# Altium project 02_MCU-ALEKSEJ.PrjPCB
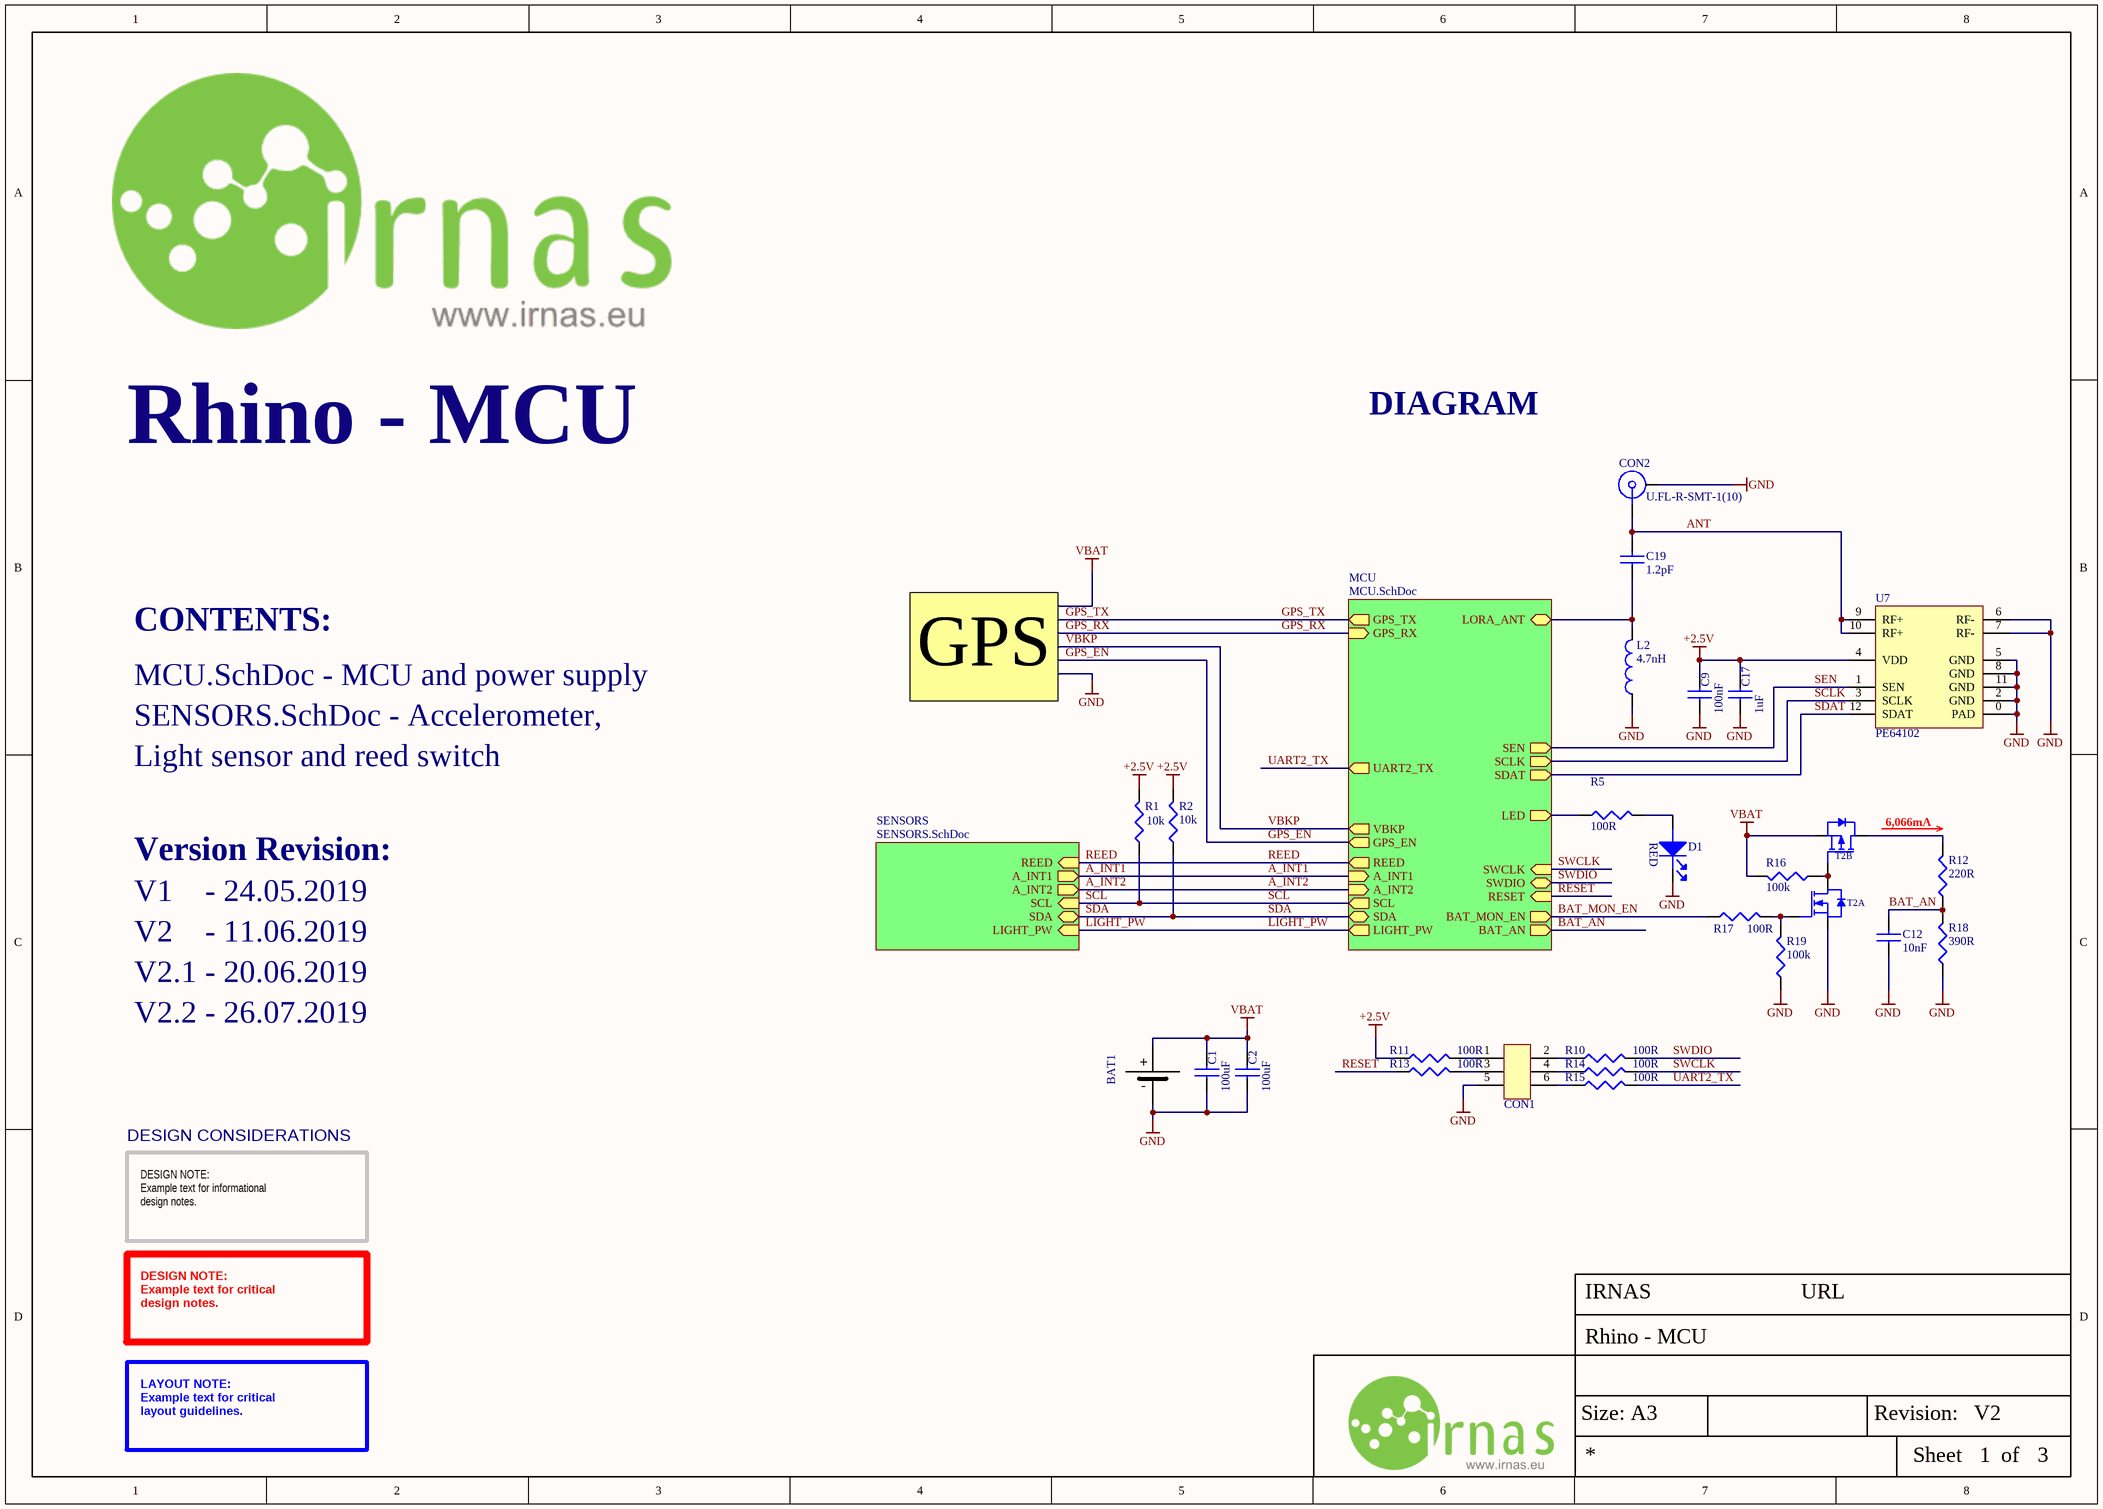
[diagram p0: MAIN.SchDoc]
Company: IRNAS; CreateDate: 13.05.2019; PCBDesigner: Aleksej Cegner; ProjectTitle: Rhino - MCU; RevisionDate: dd.mm.yyyy; Version: V2; Website: URL
3 sheets, 54 parts. Net scope: hierarchical (ports join the sheet entries above them; power ports are global).
Board files: MCU.PcbDoc, RHINO_V2_PANEL.PcbDoc
Sheets:
  MAIN.SchDoc
    SENSORS = SENSORS.SchDoc
    MCU = MCU.SchDoc

## Sheet MAIN.SchDoc
size A3; DocumentNumber: 1; SheetNumber: 1; SheetTotal: 3

### Parts
BAT1  SAFT LS 14250PFR  [SAFT LS 14250PFR]  (value not drawn)
C1  100uF  [CAP0805]
C2  100uF  [CAP0805]
C9  100nF  [CAP0402]
C12  10nF  [CAP0402]
C17  1uF  [CAP0402]
C19  1.2pF  [CAP0402]
CON1  Tag connect  [TC2030-IDC-NL]  (value not drawn)  (no BOM)
CON2  U.FL-R-SMT-1(10)  [ufl connector smd]
D1  LED RED  [LED0603]  (value not drawn)
L2  4.7nH  [IND0402]
R1  10k  [RES0402]
R2  10k  [RES0402]
R5  100R  [RES0402]
R10  100R  [RES0402]
R11  100R  [RES0402]
R12  220R  [RES0402]
R13  100R  [RES0402]
R14  100R  [RES0402]
R15  100R  [RES0402]
R16  100k  [RES0402]
R17  100R  [RES0402]
R18  390R  [RES0402]
R19  100k  [RES0402]
T2  VT6M1T2CR  [VMT6]  (value not drawn)  (parts A,B of 2)
U7  PE64102  [QFN-12]

### Sub-sheets
MCU = MCU.SchDoc: RESET (in), GPS_RX (in), SCL (out), LORA_ANT (bidir), SWDIO (bidir), GPS_EN (out), GPS_TX (out), SWCLK (in), SDA (bidir), A_INT2 (in), A_INT1 (in), REED (out), VBKP (out), BAT_AN (out), BAT_MON_EN (out), LED (out), UART2_TX (out), LIGHT_PW (out), SDAT (out), SCLK (out), SEN (out)
SENSORS = SENSORS.SchDoc: A_INT1 (out), SCL (in), SDA (bidir), A_INT2 (out), LIGHT_PW (in), REED (in)

### Nets
+2.5V: C9.2 C17.2 R1.2 R2.2 R11.1 U7.4(VDD)
GND: BAT1.1(Negative) C1.1 C2.1 C9.1 C12.1 C17.1 CON1.5 CON2.2 D1.1(cathode) L2.1 R18.1 R19.1 T2.1(S1) U7.0(PAD) U7.2(GND) U7.5(GND) U7.6(RF-) U7.7(RF-) U7.8(GND) U7.11(GND)
VBAT: BAT1.2(Positive) C1.2 C2.2 R16.2 T2.4(S2)
A_INT1: sheet SENSORS/A_INT1, sheet MCU/A_INT1
A_INT2: sheet SENSORS/A_INT2, sheet MCU/A_INT2
ANT: C19.2 CON2.1 U7.9(RF+) U7.10(RF+)
BAT_AN: C12.2 R12.1 R18.2 ; sheet MCU/BAT_AN
BAT_MON_EN: R17.1 ; sheet MCU/BAT_MON_EN
LED: R5.1 ; sheet MCU/LED
LIGHT_PW: sheet SENSORS/LIGHT_PW, sheet MCU/LIGHT_PW
LORA_ANT: C19.1 L2.2 ; sheet MCU/LORA_ANT
REED: sheet SENSORS/REED, sheet MCU/REED
RESET: R13.1 ; sheet MCU/RESET
SCL: R1.1 ; sheet SENSORS/SCL, sheet MCU/SCL
SCLK: U7.3(SCLK) ; sheet MCU/SCLK
SDA: R2.1 ; sheet SENSORS/SDA, sheet MCU/SDA
SDAT: U7.12(SDAT) ; sheet MCU/SDAT
SEN: U7.1(SEN) ; sheet MCU/SEN
SWCLK: R14.2 ; sheet MCU/SWCLK
SWDIO: R10.2 ; sheet MCU/SWDIO
UART2_TX: R15.2 ; sheet MCU/UART2_TX
NetCON1_1: CON1.1 R11.2
NetCON1_2: CON1.2 R10.1
NetCON1_3: CON1.3 R13.2
NetCON1_4: CON1.4 R14.1
NetCON1_6: CON1.6 R15.1
NetD1_2: D1.2(ANODE) R5.2
NetR12_2: R12.2 T2.3(D2)
NetR16_1: R16.1 T2.5(G2) T2.6(D1)
NetR17_2: R17.2 R19.2 T2.2(G1)

### Notes on the sheet
- DIAGRAM
- CONTENTS:
- MCU.SchDoc - MCU and power supply
- GPS
- SENSORS.SchDoc - Accelerometer,
- Light sensor and reed switch
- 6,066mA
- Version Revision:
- V1    - 24.05.2019
- V2    - 11.06.2019
- V2.1 - 20.06.2019
- V2.2 - 26.07.2019
- DESIGN CONSIDERATIONS
- DESIGN NOTE:
  Example text for informational
  design notes.
- DESIGN NOTE:
  Example text for critical
  design notes.
- LAYOUT NOTE:
  Example text for critical
  layout guidelines.
- Size: A3
- Revision:
- Sheet
- of
- (in symbol BAT - SAFT LS 14250PFR) +; -
- (in symbol LED - LED RED) RED

### Library data of the parts
BAT1 = BAT - SAFT LS 14250PFR: Battery: lithium; 3.6V; 1/2AA; 3pin,positive pole: 1pin; 1200mAh; Supplier 1: TME; Supplier Part Number 1: SAFT-LS14250PFR
C1 C2 = C - 100uF/0805: Multilayer Ceramic Capacitors MLCC - SMD/SMT 0805 100uF 4volts *Derate Voltage/Temp; Manufacturer: Murata; Manufacturer Part Number: GRM21BR60G107ME15L; IRNAS Part No.: /; Tolerance: 20%; Dielectric: X5R; Voltage Rating (DC): 4V; Dissipation Factor: 0.1%; Supplier 1: Farnell; Stock 1: 529; Pricing 1: 5=0.775, 50=0.463, 250=0.405, 500=0.289, 1500=0.243, 3000=0.229, 15000=0.21 (GBP); Mount: Surface Mount; Case/Package: 0805; Weight: 0.000335oz; Case Code (Metric): 2012; Case Code (Imperial): 0805; Dielectric Material: Ceramic; Min Operating Temperature: -55°C; Max Operating Temperature: 85°C; Packaging: Tape and Reel; Voltage Rating: 4V; Voltage: 4V; Termination: SMD/SMT; Package Quantity: 3000; Capacitance: 100uF; Length: 2mm; Height: 1.25mm; Width: 0.049inch; Thickness: 0.057inch; Depth: 1.25mm; REACH SVHC: No SVHC; Lead Free: Lead Free; ComponentLink1URL: http://www.farnell.com/datasheets/2079181.pdf; ComponentLink1Description: http://www.farnell.com/datasheets/2079181.pdf; ComponentLink2URL: http://search.murata.co.jp/Ceramy/image/img/A01X/partnumbering_e_01.pdf; ComponentLink2Description: http://search.murata.co.jp/Ceramy/image/img/A01X/partnumbering_e_01.pdf; ComponentLink3URL: http://psearch.en.murata.com/capacitor/product/GRM21BR60G107ME15%23.pdf; ComponentLink3Description: http://psearch.en.murata.com/capacitor/product/GRM21BR60G107ME15%23.pdf; ComponentLink4URL: http://www.mouser.com/ds/2/281/c02e-2905.pdf; ComponentLink4Description: http://www.mouser.com/ds/2/281/c02e-2905.pdf; Supplier Part Number 1: 2611937
C9 = C - 100nF/0402: MULTICOMP         MC0402X104J160CT             SMD Multilayer Ceramic Capacitor, 0402 [1005 Metric], 0.1 F, 16 V,  5%, X5R, MC Series                          New; IRNAS Part No.: /; Voltage Rating: 16V; Supplier 1: Farnell; Manufacturer: Multicomp; Manufacturer Part Number: MC0402X104J160CT; Stock 1: 3230; Pricing 1: 10=0.0139, 100=0.0108, 500=0.0076, 2500=0.0051, 5000=0.0038 (EUR); Case Code (Metric): 1005; Case Code (Imperial): 0402; Min Operating Temperature: -55°C; Max Operating Temperature: 85°C; Capacitance: 100nF; Dielectric: X5R; Packaging: Tape and Reel; Tolerance: 5%; Voltage Rating (DC): 16V; REACH SVHC: No SVHC; ComponentLink1URL: http://www.farnell.com/datasheets/2117933.pdf; ComponentLink1Description: http://www.farnell.com/datasheets/2117933.pdf; ComponentLink2URL: http://www.farnell.com/datasheets/2117900.pdf; ComponentLink2Description: http://www.farnell.com/datasheets/2117900.pdf; Supplier Part Number 1: 2627419
C12 = C - 10nF/0402: CAP CER 10000PF 16V X7R 0402; Manufacturer: Murata; Manufacturer Part Number: GRM155R71C103KA01D; IRNAS Part No.: /; Tolerance: 10%; Stock 1: 16478; Pricing 1: 10=0.0216, 100=0.0151, 500=0.0104, 2500=0.0069, 5000=0.0056 (EUR); Mount: Surface Mount; Case/Package: 0402; Number of Pins: 2; Case Code (Metric): 1005; Case Code (Imperial): 0402; Min Operating Temperature: -55°C; Max Operating Temperature: 125°C; Package Quantity: 1; Capacitance: 10nF; Voltage Rating: 16V; Packaging: Tape and Reel; Voltage Rating (DC): 16V; Dielectric: X7R; Termination: SMD/SMT; Voltage: 16V; Length: 1mm; Height: 0.5mm; Width: 0.02inch; Thickness: 0.022inch; Depth: 0.5mm; Radiation Hardening: No; REACH SVHC: No SVHC; Lead Free: Lead Free; ComponentLink1URL: https://datasheet.ciiva.com/129/partnumbering-e-01-129774.pdf; ComponentLink1Description: https://datasheet.ciiva.com/129/partnumbering-e-01-129774.pdf; ComponentLink2URL: https://datasheet.ciiva.com/129/partnumbering-e-01-129775.pdf; ComponentLink2Description: https://datasheet.ciiva.com/129/partnumbering-e-01-129775.pdf; ComponentLink3URL: https://datasheet.ciiva.com/129/product-129776.pdf; ComponentLink3Description: https://datasheet.ciiva.com/129/product-129776.pdf; ComponentLink4URL: https://datasheet.ciiva.com/18184/getdatasheetpartid-178863-18184649.pdf; ComponentLink4Description: https://datasheet.ciiva.com/18184/getdatasheetpartid-178863-18184649.pdf; ComponentLink5URL: https://datasheet.ciiva.com/22698/608985-22698415.pdf; ComponentLink5Description: https://datasheet.ciiva.com/22698/608985-22698415.pdf; ComponentLink6URL: https://datasheet.ciiva.com/7937/608985-7937614.pdf; ComponentLink6Description: https://datasheet.ciiva.com/7937/608985-7937614.pdf; Supplier 1: Farnell; Supplier Part Number 1: 2407354
C17 = C - 1uF/0402: CAP CER 1UF 10V 20% X5R 0402; Manufacturer: Murata; Manufacturer Part Number: GRM155R61A105ME15D; IRNAS Part No.: /; Stock 1: 0; Pricing 1: 10=0.0379, 100=0.0266, 500=0.0156, 2500=0.0098, 5000=0.0083 (EUR); Mount: Surface Mount; Case/Package: 0402; Case Code (Metric): 1005; Case Code (Imperial): 0402; Min Operating Temperature: -55°C; Max Operating Temperature: 85°C; Capacitance: 1uF; Tolerance: 20%; Voltage Rating: 10V; Packaging: Tape and Reel; Package Quantity: 1; Dielectric: X5R; Voltage: 10V; Voltage Rating (DC): 10V; Length: 1mm; Height: 0.5mm; Width: 0.02inch; Thickness: 0.022inch; Depth: 0.5mm; Radiation Hardening: No; REACH SVHC: No SVHC; Lead Free: Lead Free; ComponentLink1URL: https://datasheet.ciiva.com/164/product-164665.pdf; ComponentLink1Description: https://datasheet.ciiva.com/164/product-164665.pdf; ComponentLink2URL: https://datasheet.ciiva.com/11616/product-11616508.pdf; ComponentLink2Description: https://datasheet.ciiva.com/11616/product-11616508.pdf; ComponentLink3URL: https://datasheet.ciiva.com/46418/1769893-46418047.pdf; ComponentLink3Description: https://datasheet.ciiva.com/46418/1769893-46418047.pdf; ComponentLink4URL: https://datasheet.ciiva.com/164/partnumbering-e-01-164666.pdf; ComponentLink4Description: https://datasheet.ciiva.com/164/partnumbering-e-01-164666.pdf; ComponentLink5URL: https://datasheet.ciiva.com/164/partnumbering-e-01-164667.pdf; ComponentLink5Description: https://datasheet.ciiva.com/164/partnumbering-e-01-164667.pdf; Supplier 1: Farnell; Supplier Part Number 1: 1740588
C19 = C - 4.7nF/0402: CAP CER 4700PF 50V X7R 0402; Manufacturer: KEMET; Manufacturer Part Number: C0402C472K5RAC-TU; IRNAS Part No.: /; Dielectric Material: Ceramic; Capacitance: 4.7nF; Tolerance: 10%; Supplier 1: Farnell; Stock 1: 98953; Pricing 1: 10=0.0321, 100=0.0144, 500=0.0081, 2500=0.0057, 5000=0.0048 (EUR); Mount: Surface Mount,PCB; Case/Package: 0402; Number of Pins: 2; Case Code (Imperial): 0402; Case Code (Metric): 1005; Min Operating Temperature: -55°C; Max Operating Temperature: 125°C; Voltage Rating: 50V; Voltage Rating (DC): 50V; Packaging: Tape and Reel; Package Quantity: 1; Dielectric: X7R; Termination: SMD/SMT; Voltage: 50V; Length: 1mm; Height: 0.5mm; Width: 0.02inch; Lead Pitch: 0.3mm; Thickness: 0.022inch; Depth: 0.5mm; Radiation Hardening: No; REACH SVHC: No SVHC; ComponentLink1URL: https://datasheet.ciiva.com/7747/40889-7747549.pdf; ComponentLink1Description: https://datasheet.ciiva.com/7747/40889-7747549.pdf; ComponentLink2URL: https://datasheet.ciiva.com/7747/40889-7747550.pdf; ComponentLink2Description: https://datasheet.ciiva.com/7747/40889-7747550.pdf; ComponentLink3URL: https://datasheet.ciiva.com/14604/70095383-14604382.pdf; ComponentLink3Description: https://datasheet.ciiva.com/14604/70095383-14604382.pdf; ComponentLink4URL: https://datasheet.ciiva.com/6074/kem-c1002-x7r-smd-6074645.pdf; ComponentLink4Description: https://datasheet.ciiva.com/6074/kem-c1002-x7r-smd-6074645.pdf; ComponentLink5URL: https://datasheet.ciiva.com/14602/70095383-14602057.pdf; ComponentLink5Description: https://datasheet.ciiva.com/14602/70095383-14602057.pdf; ComponentLink6URL: https://datasheet.ciiva.com/18102/getdatasheetpartid-63228-18102058.pdf; ComponentLink6Description: https://datasheet.ciiva.com/18102/getdatasheetpartid-63228-18102058.pdf; Supplier Part Number 1: 1414594
CON1 = tag connecot 6 pin
CON2 = U.FL-R-SMT-1(10): RF / Coaxial Connector, U.FL Coaxial, Straight Jack, Surface Mount Vertical, 50 ohm, Brass; Manufacturer: Hirose; Featured Product: U.FL Series Connectors; Connector Style: U.FL, Ultra Miniature Coaxial; Connector Type: Receptacle, Male Pin; Contact Termination: Solder; Impedance: 50 Ohm; Frequency - Max: 6GHz; Body Material: Phosphor Bronze; Body Finish: Silver; Center Contact Plating: Gold; Dielectric Material: Liquid Crystal Polymer (LCP); Online Catalog: UMCC (Ultra Miniature Coax Connectors), U.FL Series; Other Names: H11891TR  Q5400621  U.FL-R-SMT-1 10  U.FL-R-SMT-1(10)-ND  UFLRSMT110; Supplier 1: Farnell; Manufacturer Part Number: U.FL-R-SMT-1(10); Stock 1: 0; Standard Package: 2,500; Category: Connectors, Interconnects; Family: Coaxial Connectors (RF); Series: U.FL; Packaging: Tape & Reel (TR); Shield Termination: Solder; Mounting Type: Surface Mount; Cable Group: -; Fastening Type: Snap-On; Features: -; Housing Color: Beige; Ingress Protection: -; Center Contact Material: Brass; Voltage Rating: -; Operating Temperature: -40°C ~ 90°C; ComponentLink1URL: http://www.farnell.com/datasheets/91524.pdf; ComponentLink1Description: http://www.farnell.com/datasheets/91524.pdf; ComponentLink2URL: http://uk.rs-online.com/webdocs/1363/0900766b81363563.pdf; ComponentLink2Description: http://uk.rs-online.com/webdocs/1363/0900766b81363563.pdf; ComponentLink3URL: http://www.farnell.com/datasheets/1947917.pdf; ComponentLink3Description: http://www.farnell.com/datasheets/1947917.pdf; Supplier Part Number 1: 1688077
D1 = LED - LED RED: BROADCOM LIMITED - HSMS-C190 - LED, RED, 10MCD, 626NM; LED Mounting: SMD; Forward Current If: 20; Forward Voltage: 2.1; Wavelength Typ: 626; Luminous Intensity: 10; Viewing Angle: 170°; Lens Shape: Rectangular; SVHC: No SVHC (17-Dec-2015)<!--FANDB--><div class="features-and-benefits-container"><div class="features-and-benefits-description"><span class="features-benefits-value">The HSMS-C190 is a HER SMD Chip LED with untinted/diffused lens, made of GaP. It is designed in an industry standard package 1.6 x 0.8mm footprint with 0.8mm profile. It is compatible with IR reflow solder processes. The small size and wide viewing angle make this LED prime choices for backlighting applications and front panel illumination especially where space is a premium.</span></div><div class="features-and-benefits-list"><ul class="features-and-benefits-list-list"><li class="features-and-benefits-list-item">Small size</li><li class="features-and-benefits-list-item">Industry standard footprint</li><li class="features-and-benefits-list-item">Compatible with IR solder</li><li class="features-and-benefits-list-item">Diffused optics</li><li class="features-and-benefits-list-item">-40 to 85; Supplier 1: Farnell; Manufacturer: BROADCOM LIMITED; Manufacturer Part Number: HSMS-C190; RoHS: YES; Stock 1: 7534; Pricing 1: 1=0.361, 10=0.256, 50=0.235, 100=0.106, 200=0.101 (GBP); LED Colour: Red; Bulb Size: -; Packaging: Cut Tape; Product Range: -; Automotive Qualification Standard: -; MSL: -; ComponentLink1URL: http://www.farnell.com/datasheets/313031.pdf; ComponentLink1Description: http://www.farnell.com/datasheets/313031.pdf; ComponentLink2URL: http://www.farnell.com/datasheets/1681524.pdf; ComponentLink2Description: http://www.farnell.com/datasheets/1681524.pdf; ComponentLink3URL: http://www.farnell.com/datasheets/2165483.pdf; ComponentLink3Description: http://www.farnell.com/datasheets/2165483.pdf; Supplier Part Number 1: 2497356
L2 = L - 4.3nH/0402: Inductor RF Chip Multi-Layer 4.3nH 0.3nH 100MHz 8Q-Factor Air 300mA 210mOhm DCR 0402 Paper T/R; Manufacturer: Murata; Manufacturer Part Number: LQG15HN4N3S02D; IRNAS Part No.: /; Q Factor: 8; Self Resonant Frequency: 6GHz; Shielding: Unshielded; DC Resistance (DCR): 210mR; Stock 1: 3502; Pricing 1: 1 = 0.10000, 10 = 0.06100, 100 = 0.04040, 500 = 0.03366, 1000 = 0.02827, 2500 = 0.02423 (USD); RoHS: Yes; Mount: Surface Mount; Case/Package: 0402; Core Material: Air; Case Code (Metric): 1005; Case Code (Imperial): 0402; Min Operating Temperature: -55°C; Max Operating Temperature: 125°C; Package Quantity: 10000; Packaging: Tape and Reel; Current Rating: 300mA; Inductance: 4.3nh; Test Frequency: 100MHz; Max DC Current: 300mA; Termination: SMD/SMT; Current: 300mA; DC Current: 300mA; Military Standard: Not; Length: 1.05mm; Height: 0.5mm; Width: 0.02inch; Height - Seated (Max): 0.022inch; Depth: 0.55mm; Radiation Hardening: No; REACH SVHC: No SVHC; Lead Free: Lead Free; ComponentLink1URL: http://uk.rs-online.com/webdocs/0f10/0900766b80f10808.pdf?src-supplier=RSComponents; ComponentLink1Description: http://uk.rs-online.com/webdocs/0f10/0900766b80f10808.pdf?src-supplier=RSComponents; ComponentLink2URL: http://search.murata.co.jp/Ceramy/image/img/PDF/ENG/L0075S0083LQG15HN.pdf?src-supplier=Avnet; ComponentLink2Description: http://search.murata.co.jp/Ceramy/image/img/PDF/ENG/L0075S0083LQG15HN.pdf?src-supplier=Avnet; ComponentLink3URL: http://www.farnell.com/datasheets/66026.pdf?src-supplier=Element14; ComponentLink3Description: http://www.farnell.com/datasheets/66026.pdf?src-supplier=Element14; ComponentLink4URL: https://www.verical.com/server-webapp/html/getDatasheet?partID=31252&src-supplier=Verical; ComponentLink4Description: https://www.verical.com/server-webapp/html/getDatasheet?partID=31252&src-supplier=Verical; ComponentLink5URL: http://search.murata.co.jp/Ceramy/image/img/PDF/ENG/L0075S0083LQG15HN.pdf?src-supplier=Avnet+Europe; ComponentLink5Description: http://search.murata.co.jp/Ceramy/image/img/PDF/ENG/L0075S0083LQG15HN.pdf?src-supplier=Avnet+Europe; ComponentLink6URL: https://search.murata.co.jp/Ceramy/image/img/P02/partnumberingAT_LQ3E.pdf?src-supplier=Digi-Key; ComponentLink6Description: https://search.murata.co.jp/Ceramy/image/img/P02/partnumberingAT_LQ3E.pdf?src-supplier=Digi-Key; Supplier 1: Farnell; Supplier Part Number 1: 1711735
R1 R2 = R - 10k/0402: MULTICOMP         MCWR04X1002FTL             SMD Chip Resistor, Thick Film, 10 kohm, 50 V, 0402 [1005 Metric], 62.5 mW,  1%, MCWR Series; IRNAS Part No.: I-100014; Resistance: 10kR; Voltage Rating: 50V; Power Rating: 62.5mW; Temperature Coefficient: 100ppm/°C; Supplier 1: Farnell; Manufacturer: Multicomp; Manufacturer Part Number: MCWR04X1002FTL; Stock 1: 602609; Pricing 1: 10=0.0029, 100=0.0017, 500=0.0012, 2500=0.001, 5000=0.0008 (EUR); Case/Package: 0402; Case Code (Metric): 1005; Case Code (Imperial): 0402; Packaging: Cut Tape; Composition: Thick Film; Tolerance: 1%; Voltage Rating (DC): 50V; REACH SVHC: No SVHC; ComponentLink1URL: http://www.farnell.com/datasheets/1849611.pdf; ComponentLink1Description: http://www.farnell.com/datasheets/1849611.pdf; Supplier Part Number 1: 2447096
R5 R10 R11 R13-R15 R17 = R - 100R/0402: MULTICOMP         MCMR04X1000FTL            SMD Chip Resistor, Ceramic, MCMR Series, 100 ohm, 50 V, 0402 [1005 Metric], 62.5 mW,  1%; IRNAS Part No.: /; Temperature Coefficient: 100ppm/°C; Power Rating: 62.5mW; Voltage Rating: 50V; Supplier 1: Farnell; Manufacturer: Multicomp; Manufacturer Part Number: MCMR04X1000FTL; Stock 1: 62365; Pricing 1: 10=0.0071, 100=0.0042, 500=0.003, 2500=0.0024, 5000=0.0019 (GBP); Case/Package: 0402; Case Code (Metric): 1005; Case Code (Imperial): 0402; Resistance: 100R; Tolerance: 1%; Composition: Ceramic; Packaging: Cut Tape; Voltage Rating (DC): 50V; REACH SVHC: No SVHC; ComponentLink1URL: https://datasheet.ciiva.com/28692/1716705-28692087.pdf; ComponentLink1Description: https://datasheet.ciiva.com/28692/1716705-28692087.pdf; ComponentLink2URL: https://datasheet.ciiva.com/22708/1716705-22708156.pdf; ComponentLink2Description: https://datasheet.ciiva.com/22708/1716705-22708156.pdf; Supplier Part Number 1: 2072515
R12 = R - 220R/0402: SMD Chip Resistor, 0402 [1005 Metric], 220 ohm, CRCW e3 Series, 50 V, Thick Film, 63 mW; Manufacturer: Multicomp; IRNAS Part No.: /; Voltage Rating: 50V; Power Rating: 62.5mW; Temperature Coefficient: 400ppm/°C; Stock 1: 0; Pricing 1: 10=0.0057, 100=0.0034, 500=0.0024, 2500=0.0019, 5000=0.0015 (EUR); Case/Package: 0402; Case Code (Metric): 1005; Case Code (Imperial): 0402; Packaging: Cut Tape; Resistance: 220R; Composition: Ceramic; Voltage Rating (DC): 50V; REACH SVHC: No SVHC; ComponentLink1URL: http://www.farnell.com/datasheets/2310790.pdf?_ga=2.80708247.1822379758.1564985606-1373726713.1554121096&_gac=1.157944520.1562763802.CjwKCAjwmZbpBRAGEiwADrmVXm8xT8OHDZvJe8qZIQyyGmIuiUD-TEITatw0hIdDkyBwIXXCH7oneRoCl7cQAvD_BwE; ComponentLink1Description: Datasheet; Supplier 1: Farnell; Supplier Part Number 1: 2140704
R16 R19 = R - 100k/0402: MULTICOMP   MCWR04X1003FTL   RES, THICK FILM, 100KOHM, 1%, 0.0625W; IRNAS Part No.: I-100013; Resistance: 100kR; Power Rating: 62.5mW; Voltage Rating: 50V; Temperature Coefficient: 100ppm/°C; Supplier 1: Farnell; Manufacturer: Multicomp; Manufacturer Part Number: MCWR04X1003FTL; Stock 1: 161188; Pricing 1: 10=0.0029, 100=0.0017, 500=0.0012, 2500=0.001, 5000=0.0008 (EUR); Mount: Surface Mount; Case/Package: 0402; Case Code (Metric): 1005; Case Code (Imperial): 0402; Tolerance: 1%; Packaging: Cut Tape; Composition: Thick Film; Voltage Rating (DC): 50V; REACH SVHC: No SVHC; ComponentLink1URL: https://datasheet.ciiva.com/46386/1849611-46386524.pdf; ComponentLink1Description: https://datasheet.ciiva.com/46386/1849611-46386524.pdf; Supplier Part Number 1: 2447094
R18 = R - 390R/0402: SMD Chip Resistor, 0402 [1005 Metric], 390 ohm, MCWR Series, 50 V, Thick Film, 62.5 mW; Manufacturer: Multicomp; IRNAS Part No.: /; Voltage Rating: 50V; Power Rating: 62.5mW; Temperature Coefficient: 400ppm/°C; Stock 1: 0; Pricing 1: 10=0.0057, 100=0.0034, 500=0.0024, 2500=0.0019, 5000=0.0015 (EUR); Case/Package: 0402; Case Code (Metric): 1005; Case Code (Imperial): 0402; Packaging: Cut Tape; Resistance: 390R; Composition: Ceramic; Voltage Rating (DC): 50V; REACH SVHC: No SVHC; ComponentLink1URL: http://www.farnell.com/datasheets/2563624.pdf?_ga=2.57959210.1822379758.1564985606-1373726713.1554121096&_gac=1.48955732.1562763802.CjwKCAjwmZbpBRAGEiwADrmVXm8xT8OHDZvJe8qZIQyyGmIuiUD-TEITatw0hIdDkyBwIXXCH7oneRoCl7cQAvD_BwE; ComponentLink1Description: Datasheet; Supplier 1: Farnell; Supplier Part Number 1: 2447165
T2 = T_M - VT6M1T2CR: Dual MOSFET, N and P Channel, 100 mA, 20 V, 2.5 ohm, 4.5 V, 1 V; ELRAD Id sifra / ELRAD Id No: 597778; Opis / Description: MOSFET BSS123       /N-Channel; Komp / Device: SMD; Value: BSS123; Velikost / Size: SOT23; FIT: 0.44; Author: Ciril Golob; Date: 11.07.2018; ComponentLINK1Description: Datasheet; ComponentLINK2Description: Datasheet www; ComponentLINK1URL: c:\ELRADSVN\Altium_Library\Libraries\Active\Datasheet\BSS123.pdf; ComponentLINK2URL: http://www.onsemi.com/pub/Collateral/BSS123-D.PDF; ComponentLink1Description: Datasheet; ComponentLink1URL: http://www.farnell.com/datasheets/2198041.pdf?_ga=2.191543850.1451481302.1563774341-1373726713.1554121096&_gac=1.95045230.1562763802.CjwKCAjwmZbpBRAGEiwADrmVXm8xT8OHDZvJe8qZIQyyGmIuiUD-TEITatw0hIdDkyBwIXXCH7oneRoCl7cQAvD_BwE; Supplier 1: Farnell; Supplier Part Number 1: 2706721
U7 = RF - PE64102: RF IC Digitally Tunable Capacitor General Purpose 100MHz ~ 3GHz SPI Interface 12-QFN (2x2); Manufacturer: u-blox; Manufacturer Part Number: MAX-M8Q-0; Stock 1: 10805; Supplier 1: Digi-Key; Supplier Part Number 1: 1046-1066-1-ND

## Sheet SENSORS.SchDoc
size A3; DocumentNumber: 3; SheetNumber: 3; SheetTotal: 3
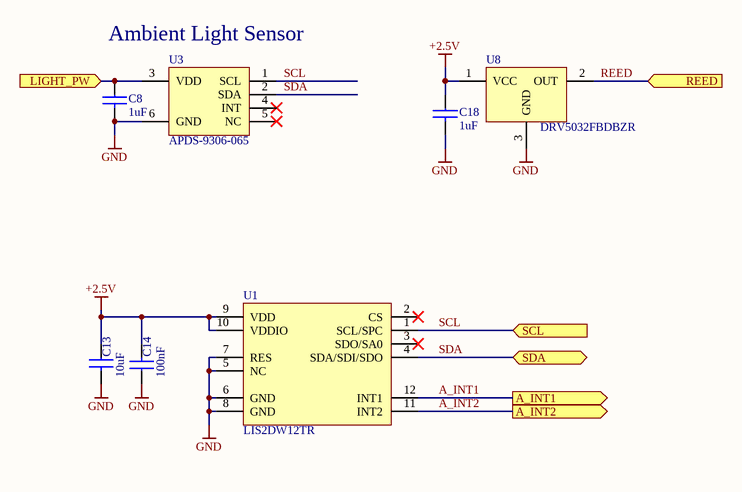
[diagram p1: SENSORS.SchDoc]

### Parts
C8  1uF  [CAP0402]
C13  10uF  [CAP0603]
C14  100nF  [CAP0402]
C18  1uF  [CAP0402]
U1  LIS2DW12TR  [LGA-12]
U3  APDS-9306-065  [APDS-9306]
U8  DRV5032FBDBZR  [SOT23-3AL]

### Ports
A_INT1 (out), A_INT2 (out), LIGHT_PW (in), REED (in), SCL (in), SDA (bidir)

### Nets
+2.5V: C13.1 C14.2 C18.1 U1.9(VDD) U1.10(VDDIO) U8.1(VCC)
GND: C8.2 C13.2 C14.1 C18.2 U1.5(NC) U1.6(GND) U1.7(RES) U1.8(GND) U3.6(GND) U8.3(GND)
A_INT1: U1.12(INT1) ; port A_INT1
A_INT2: U1.11(INT2) ; port A_INT2
LIGHT_PW: C8.1 U3.3(VDD) ; port LIGHT_PW
REED: U8.2(OUT) ; port REED
SCL: U1.1(SCL/SPC) U3.1(SCL) ; port SCL
SDA: U1.4(SDA/SDI/SDO) U3.2(SDA) ; port SDA

Not connected (* = marked no-connect by the designer): U1 2(CS)* 3(SDO/SA0)*; U3 4(INT)* 5(NC)*

### Notes on the sheet
- Ambient Light Sensor
- Size: A3
- Revision:
- Sheet
- of

### Library data of the parts
C8 C18 = C - 1uF/0402: as C17 on sheet MAIN; Stock 1: 0; Pricing 1: 10=0.0379, 100=0.0266, 500=0.0156, 2500=0.0098, 5000=0.0083 (EUR); Mount: Surface Mount; Case/Package: 0402; Case Code (Metric): 1005; Case Code (Imperial): 0402; Min Operating Temperature: -55°C; Max Operating Temperature: 85°C; Capacitance: 1uF; Tolerance: 20%; Voltage Rating: 10V; Packaging: Tape and Reel; Package Quantity: 1; Dielectric: X5R; Voltage: 10V; Voltage Rating (DC): 10V; Length: 1mm; Height: 0.5mm; Width: 0.02inch; Thickness: 0.022inch; Depth: 0.5mm; Radiation Hardening: No; REACH SVHC: No SVHC; Lead Free: Lead Free; ComponentLink1URL: https://datasheet.ciiva.com/164/product-164665.pdf; ComponentLink1Description: https://datasheet.ciiva.com/164/product-164665.pdf; ComponentLink2URL: https://datasheet.ciiva.com/11616/product-11616508.pdf; ComponentLink2Description: https://datasheet.ciiva.com/11616/product-11616508.pdf; ComponentLink3URL: https://datasheet.ciiva.com/46418/1769893-46418047.pdf; ComponentLink3Description: https://datasheet.ciiva.com/46418/1769893-46418047.pdf; ComponentLink4URL: https://datasheet.ciiva.com/164/partnumbering-e-01-164666.pdf; ComponentLink4Description: https://datasheet.ciiva.com/164/partnumbering-e-01-164666.pdf; ComponentLink5URL: https://datasheet.ciiva.com/164/partnumbering-e-01-164667.pdf; ComponentLink5Description: https://datasheet.ciiva.com/164/partnumbering-e-01-164667.pdf; Supplier 1: Farnell; Supplier Part Number 1: 1740588
C13 = C - 10uF/10V: Cap Ceramic 10uF 10V X5R 10% SMD 0603 85C Paper T/R; Manufacturer: Samsung; Manufacturer Part Number: CL10A106KP8NNNC; IRNAS Part No.: /; Stock 1: 2844657; Pricing 1: 1=0.36, 10=0.248, 100=0.1403, 500=0.099, 1000=0.08663 (USD); Mount: Surface Mount; Case/Package: 0603; Case Code (Metric): 1608; Case Code (Imperial): 0603; Material: Ceramic; Contact Plating: Tin; Min Operating Temperature: -55°C; Max Operating Temperature: 85°C; Capacitance: 10uF; Tolerance: 10%; Package Quantity: 1; Packaging: Tape and Reel; Voltage Rating: 10V; Dielectric: X5R; Voltage Rating (DC): 10V; Length: 1.6mm; Height: 0.8mm; Width: 0.031inch; Thickness: 0.035inch; Depth: 0.8mm; Radiation Hardening: No; Lead Free: Lead Free; ComponentLink1URL: https://www.verical.com/server-webapp/html/getDatasheet?partID=359551; ComponentLink1Description: https://www.verical.com/server-webapp/html/getDatasheet?partID=359551; ComponentLink2URL: http://www1.futureelectronics.com/doc/SAMSUNG%20PASSIVE/CL05B104KQ5NNNC.pdf; ComponentLink2Description: http://www1.futureelectronics.com/doc/SAMSUNG%20PASSIVE/CL05B104KQ5NNNC.pdf; ComponentLink3URL: https://produktinfo.conrad.com/datenblaetter/450000-474999/457369-da-01-en-VS_KONDENSATOR_0603.pdf; ComponentLink3Description: https://produktinfo.conrad.com/datenblaetter/450000-474999/457369-da-01-en-VS_KONDENSATOR_0603.pdf; Supplier 1: Farnell; Supplier Part Number 1: 2456110
C14 = C - 100nF/0402: as C9 on sheet MAIN; Supplier 1: Farnell; Manufacturer: Multicomp; Manufacturer Part Number: MC0402X104J160CT; Stock 1: 3230; Pricing 1: 10=0.0139, 100=0.0108, 500=0.0076, 2500=0.0051, 5000=0.0038 (EUR); Case Code (Metric): 1005; Case Code (Imperial): 0402; Min Operating Temperature: -55°C; Max Operating Temperature: 85°C; Capacitance: 100nF; Dielectric: X5R; Packaging: Tape and Reel; Tolerance: 5%; Voltage Rating (DC): 16V; REACH SVHC: No SVHC; ComponentLink1URL: http://www.farnell.com/datasheets/2117933.pdf; ComponentLink1Description: http://www.farnell.com/datasheets/2117933.pdf; ComponentLink2URL: http://www.farnell.com/datasheets/2117900.pdf; ComponentLink2Description: http://www.farnell.com/datasheets/2117900.pdf; Supplier Part Number 1: 2627419
U1 = SEN - LIS2DW12TR: MEMS Accelerometer, Digital, X, Y, Z, ± 2g, ± 4g, ± 8g, ± 16g, 1.62 V, 3.6 V; Manufacturer: TDK InvenSense; Interface: I2C; Max Supply Voltage: 3.6V; Min Supply Voltage: 2.4V; Output Type: SPI; Manufacturer Part Number: MPU-9250; Stock 1: 0; RoHS: Yes; Mount: Surface Mount; Case/Package: QFN; Number of Pins: 24; Min Operating Temperature: -40°C; Max Operating Temperature: 85°C; Package Quantity: 1; Sensor Type: Accelerometer; Length: 3.1mm; Height: 1mm; Width: 3.1mm; ComponentLink1Description: Datasheet; ComponentLink1URL: D:\altium\Altium_Library\Active\Datasheet\LIS2DW12TR.pdf; Supplier 1: Farnell; Supplier Part Number 1: 2849615
U3 = SEN - APDS-9306-065: Ambient Light Photo Sensor, Digital I2C Output, 560nm Peak Sensitivity, 1.7V to 3.6V Supply; Manufacturer: TDK InvenSense; Sensor Type: Accelerometer; Min Supply Voltage: 2.4V; Output Type: SPI; Manufacturer Part Number: MPU-9250; Stock 1: 0; RoHS: Yes; Mount: Surface Mount; Case/Package: QFN; Number of Pins: 24; Min Operating Temperature: -40°C; Max Operating Temperature: 85°C; Package Quantity: 1; Interface: I2C; Max Supply Voltage: 3.6V; Length: 3.1mm; Height: 1mm; Width: 3.1mm; ComponentLink1Description: Datasheet; ComponentLink1URL: D:\altium\Altium_Library\Active\Datasheet\APDS-9306.pdf; Supplier 1: Farnell; Supplier Part Number 1: 2908903
U8 = SEN - DRV5032FBDBZR: Board Mount Hall Effect/Magnetic Sensors LP HALL 32FBDBZR; Manufacturer: TDK InvenSense; Interface: I2C; Sensor Type: Accelerometer; Max Supply Voltage: 3.6V; Min Supply Voltage: 2.4V; Output Type: SPI; Manufacturer Part Number: MPU-9250; Stock 1: 0; RoHS: Yes; Mount: Surface Mount; Case/Package: QFN; Number of Pins: 24; Min Operating Temperature: -40°C; Max Operating Temperature: 85°C; Package Quantity: 1; Length: 3.1mm; Height: 1mm; Width: 3.1mm; ComponentLink1Description: Datasheet; ComponentLink1URL: http://www.ti.com/general/docs/suppproductinfo.tsp?distId=26&gotoUrl=http%3A%2F%2Fwww.ti.com%2Flit%2Fgpn%2Fdrv5032; Supplier 1: Mouser; Supplier Part Number 1: 595-DRV5032FBDBZR

## Sheet MCU.SchDoc
size A3; DocumentNumber: 2; SheetNumber: 2; SheetTotal: 3
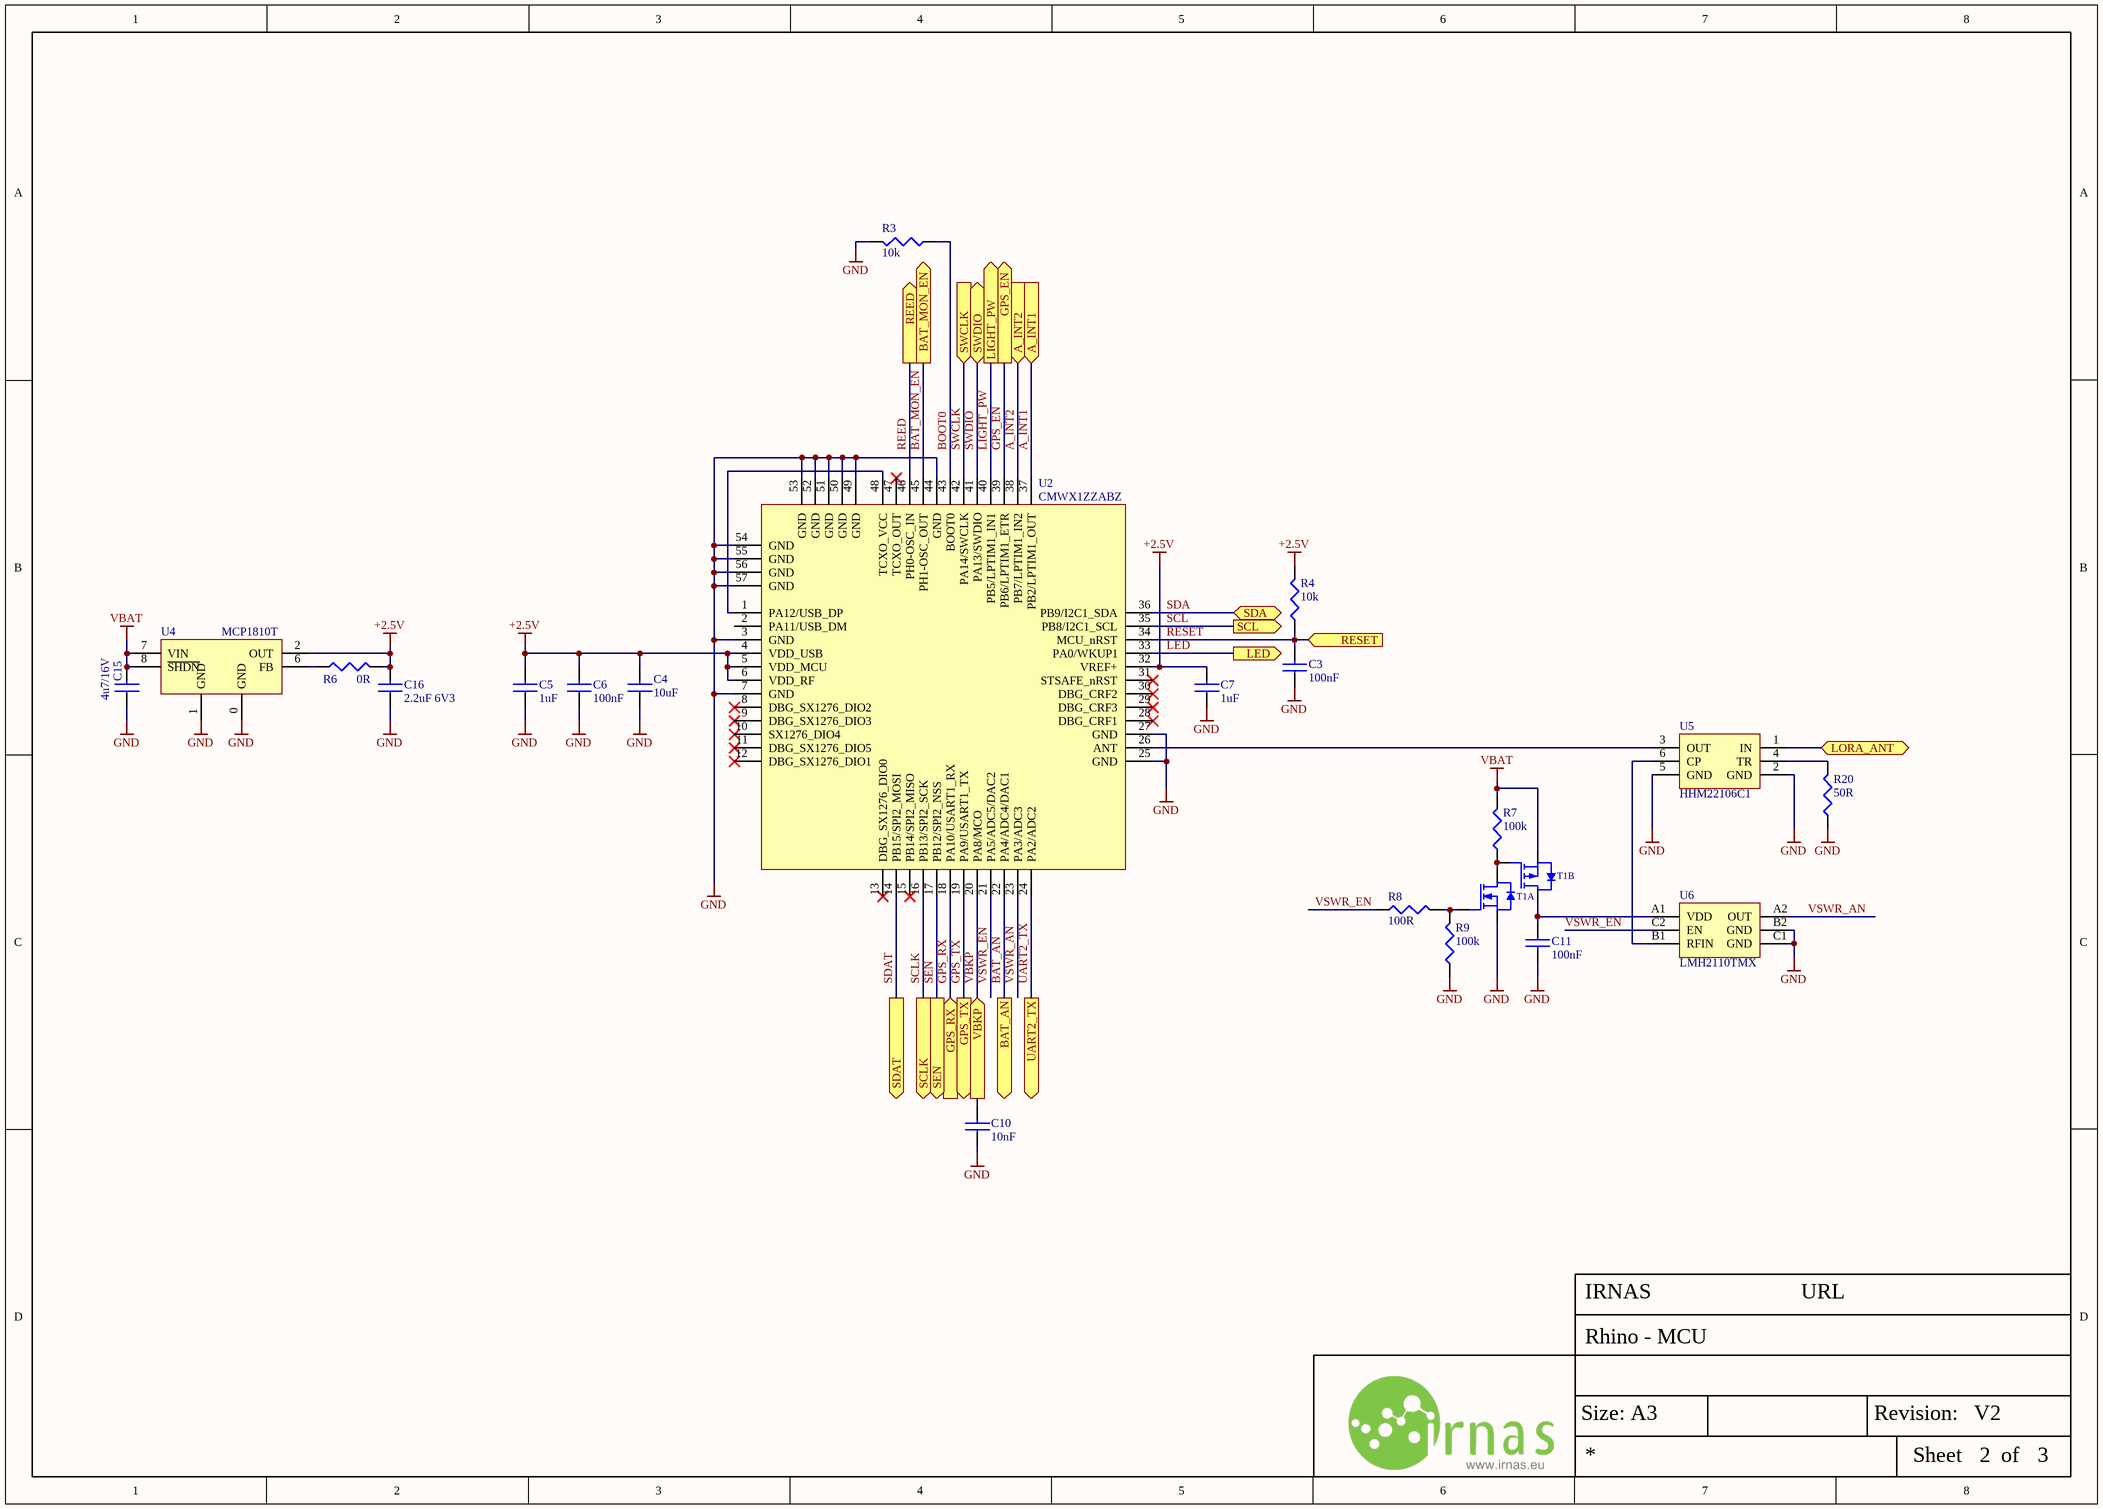
[diagram p2: MCU.SchDoc]

### Parts
C3  100nF  [CAP0402]
C4  10uF  [CAP0603]
C5  1uF  [CAP0402]
C6  100nF  [CAP0402]
C7  1uF  [CAP0402]
C10  10nF  [CAP0402]
C11  100nF  [CAP0402]
C15  4u7/16V  [CAP0603]
C16  2.2uF 6V3  [CAP0402]
R3  10k  [RES0402]
R4  10k  [RES0402]
R6  0R  [RES0402]
R7  100k  [RES0402]
R8  100R  [RES0402]
R9  100k  [RES0402]
R20  50R  [RES0402]
T1  VT6M1T2CR  [VMT6]  (value not drawn)  (parts A,B of 2)
U2  CMWX1ZZABZ  [Lora Module ES0]
U4  MCP1810T  [VDFN_2x2]
U5  HHM22106C1  [HHM22106C1]
U6  LMH2110TMX  [DSBGA-6]

### Ports
A_INT1 (in), A_INT2 (in), BAT_AN (out), BAT_MON_EN (out), GPS_EN (out), GPS_RX (in), GPS_TX (out), LED (out), LIGHT_PW (out), LORA_ANT (bidir), REED (out), RESET (in), SCL (out), SCLK (out), SDA (bidir), SDAT (out), SEN (out), SWCLK (in), SWDIO (bidir), UART2_TX (out), VBKP (out)

### Nets
+2.5V: C4.2 C5.2 C6.2 C7.2 C16.2 R4.2 R6.2 U2.4(VDD_USB) U2.5(VDD_MCU) U2.6(VDD_RF) U2.32(VREF+) U4.2(OUT)
GND: C3.1 C4.1 C5.1 C6.1 C7.1 C10.1 C11.2 C15.1 C16.1 R3.2 R9.1 R20.1 T1.1(S1) U2.3(GND) U2.7(GND) U2.25(GND) U2.27(GND) U2.44(GND) U2.49(GND) U2.50(GND) U2.51(GND) U2.52(GND) U2.53(GND) U2.54(GND) U2.55(GND) U2.56(GND) U2.57(GND) U4.0(GND) U4.1(GND) U5.2(GND) U5.5(GND) U6.B2(GND) U6.C1(GND)
VBAT: C15.2 R7.2 T1.4(S2) U4.7(VIN) U4.8(~{SHDN})
A_INT1: U2.37(PB2/LPTIM1_OUT) ; port A_INT1
A_INT2: U2.38(PB7/LPTIM1_IN2) ; port A_INT2
BAT_AN: U2.22(PA4/ADC4/DAC1) ; port BAT_AN
BAT_MON_EN: U2.45(PH1-OSC_OUT) ; port BAT_MON_EN
BOOT0: R3.1 U2.43(BOOT0)
GPS_EN: U2.39(PB6/LPTIM1_ETR) ; port GPS_EN
GPS_RX: U2.18(PA10/USART1_RX) ; port GPS_RX
GPS_TX: U2.19(PA9/USART1_TX) ; port GPS_TX
LED: U2.33(PA0/WKUP1) ; port LED
LIGHT_PW: U2.40(PB5/LPTIM1_IN1) ; port LIGHT_PW
LORA_ANT: U5.1(IN) ; port LORA_ANT
REED: U2.46(PH0-OSC_IN) ; port REED
RESET: C3.2 R4.1 U2.34(MCU_nRST) ; port RESET
SCL: U2.35(PB8/I2C1_SCL) ; port SCL
SCLK: U2.16(PB13/SPI2_SCK) ; port SCLK
SDA: U2.36(PB9/I2C1_SDA) ; port SDA
SDAT: U2.14(PB15/SPI2_MOSI) ; port SDAT
SEN: U2.17(PB12/SPI2_NSS) ; port SEN
SWCLK: U2.42(PA14/SWCLK) ; port SWCLK
SWDIO: U2.41(PA13/SWDIO) ; port SWDIO
UART2_TX: U2.24(PA2/ADC2) ; port UART2_TX
VBKP: C10.2 U2.20(PA8/MCO) ; port VBKP
VSWR_AN: U2.23(PA3/ADC3) U6.A2(OUT)
VSWR_EN: R8.1 U2.21(PA5/ADC5/DAC2) U6.C2(EN)
NetC11_1: C11.1 T1.3(D2) U6.A1(VDD)
NetR6_1: R6.1 U4.6(FB)
NetR7_1: R7.1 T1.5(G2) T1.6(D1)
NetR8_2: R8.2 R9.2 T1.2(G1)
NetR20_2: R20.2 U5.4(TR)
NetU2_1: U2.1(PA12/USB_DP) U2.48(TCXO_VCC)
NetU2_26: U2.26(ANT) U5.3(OUT)
NetU5_6: U5.6(CP) U6.B1(RFIN)

Not connected (* = marked no-connect by the designer): U2 2(PA11/USB_DM) 8(DBG_SX1276_DIO2)* 9(DBG_SX1276_DIO3)* 10(SX1276_DIO4)* 11(DBG_SX1276_DIO5)* 12(DBG_SX1276_DIO1)* 13(DBG_SX1276_DIO0)* 15(PB14/SPI2_MISO)* 28(DBG_CRF1)* 29(DBG_CRF3)* 30(DBG_CRF2)* 31(STSAFE_nRST)* 47(TCXO_OUT)*

### Notes on the sheet
- Size: A3
- Revision:
- Sheet
- of

### Library data of the parts
C3 C6 C11 = C - 100nF/0402: as C9 on sheet MAIN; Supplier 1: Farnell; Manufacturer: Multicomp; Manufacturer Part Number: MC0402X104J160CT; Stock 1: 3230; Pricing 1: 10=0.0139, 100=0.0108, 500=0.0076, 2500=0.0051, 5000=0.0038 (EUR); Case Code (Metric): 1005; Case Code (Imperial): 0402; Min Operating Temperature: -55°C; Max Operating Temperature: 85°C; Capacitance: 100nF; Dielectric: X5R; Packaging: Tape and Reel; Tolerance: 5%; Voltage Rating (DC): 16V; REACH SVHC: No SVHC; ComponentLink1URL: http://www.farnell.com/datasheets/2117933.pdf; ComponentLink1Description: http://www.farnell.com/datasheets/2117933.pdf; ComponentLink2URL: http://www.farnell.com/datasheets/2117900.pdf; ComponentLink2Description: http://www.farnell.com/datasheets/2117900.pdf; Supplier Part Number 1: 2627419
C4 = 10uF: 10uf/0603/20%; Manufacturer: KEMET; Manufacturer Part Number: C0603C106M8PACTU; Stock 1: 0; Pricing 1: 10=0.555, 100=0.315, 500=0.238, 1000=0.2, 2000=0.174, 4000=0.143, 20000=0.123 (GBP); Supplier 1: Farnell; Supplier Part Number 1: 2456110
C5 C7 = C - 1uF/0402: as C17 on sheet MAIN; Stock 1: 0; Pricing 1: 10=0.0379, 100=0.0266, 500=0.0156, 2500=0.0098, 5000=0.0083 (EUR); Mount: Surface Mount; Case/Package: 0402; Case Code (Metric): 1005; Case Code (Imperial): 0402; Min Operating Temperature: -55°C; Max Operating Temperature: 85°C; Capacitance: 1uF; Tolerance: 20%; Voltage Rating: 10V; Packaging: Tape and Reel; Package Quantity: 1; Dielectric: X5R; Voltage: 10V; Voltage Rating (DC): 10V; Length: 1mm; Height: 0.5mm; Width: 0.02inch; Thickness: 0.022inch; Depth: 0.5mm; Radiation Hardening: No; REACH SVHC: No SVHC; Lead Free: Lead Free; ComponentLink1URL: https://datasheet.ciiva.com/164/product-164665.pdf; ComponentLink1Description: https://datasheet.ciiva.com/164/product-164665.pdf; ComponentLink2URL: https://datasheet.ciiva.com/11616/product-11616508.pdf; ComponentLink2Description: https://datasheet.ciiva.com/11616/product-11616508.pdf; ComponentLink3URL: https://datasheet.ciiva.com/46418/1769893-46418047.pdf; ComponentLink3Description: https://datasheet.ciiva.com/46418/1769893-46418047.pdf; ComponentLink4URL: https://datasheet.ciiva.com/164/partnumbering-e-01-164666.pdf; ComponentLink4Description: https://datasheet.ciiva.com/164/partnumbering-e-01-164666.pdf; ComponentLink5URL: https://datasheet.ciiva.com/164/partnumbering-e-01-164667.pdf; ComponentLink5Description: https://datasheet.ciiva.com/164/partnumbering-e-01-164667.pdf; Supplier 1: Farnell; Supplier Part Number 1: 1740588
C10 = C - 10nF/0402: as C12 on sheet MAIN; Stock 1: 16478; Pricing 1: 10=0.0216, 100=0.0151, 500=0.0104, 2500=0.0069, 5000=0.0056 (EUR); Mount: Surface Mount; Case/Package: 0402; Number of Pins: 2; Case Code (Metric): 1005; Case Code (Imperial): 0402; Min Operating Temperature: -55°C; Max Operating Temperature: 125°C; Package Quantity: 1; Capacitance: 10nF; Voltage Rating: 16V; Packaging: Tape and Reel; Voltage Rating (DC): 16V; Dielectric: X7R; Termination: SMD/SMT; Voltage: 16V; Length: 1mm; Height: 0.5mm; Width: 0.02inch; Thickness: 0.022inch; Depth: 0.5mm; Radiation Hardening: No; REACH SVHC: No SVHC; Lead Free: Lead Free; ComponentLink1URL: https://datasheet.ciiva.com/129/partnumbering-e-01-129774.pdf; ComponentLink1Description: https://datasheet.ciiva.com/129/partnumbering-e-01-129774.pdf; ComponentLink2URL: https://datasheet.ciiva.com/129/partnumbering-e-01-129775.pdf; ComponentLink2Description: https://datasheet.ciiva.com/129/partnumbering-e-01-129775.pdf; ComponentLink3URL: https://datasheet.ciiva.com/129/product-129776.pdf; ComponentLink3Description: https://datasheet.ciiva.com/129/product-129776.pdf; ComponentLink4URL: https://datasheet.ciiva.com/18184/getdatasheetpartid-178863-18184649.pdf; ComponentLink4Description: https://datasheet.ciiva.com/18184/getdatasheetpartid-178863-18184649.pdf; ComponentLink5URL: https://datasheet.ciiva.com/22698/608985-22698415.pdf; ComponentLink5Description: https://datasheet.ciiva.com/22698/608985-22698415.pdf; ComponentLink6URL: https://datasheet.ciiva.com/7937/608985-7937614.pdf; ComponentLink6Description: https://datasheet.ciiva.com/7937/608985-7937614.pdf; Supplier 1: Farnell; Supplier Part Number 1: 2407354
C15 = C - 4u7  16V 0603: MURATA - GRM188R61C475KAAJD - CAP, MLCC, X5R, 4.7UF, 16V, 0603; IRNAS Part No.: I-200001; Ceramic Capacitor Case: 0603 [1608 Metric]; Capacitance: 4.7; Voltage Rating: 16; Capacitance Tolerance: ± 10%; Dielectric Characteristic: X5; Product Range: GRM Series; SVHC: No SVHC (17-Dec-2015)<!--FANDB--><div class="features-and-benefits-container"><div class="features-and-benefits-desc-container"><span class="features-and-benefits-container-desc">SMD Multilayer Ceramic Capacitor, 0603 [1608 Metric], 4.7 µF, 16 V, ± 10%, X5; Supplier 1: Farnell; Manufacturer: MURATA; Manufacturer Part Number: GRM188R61C475KAAJD; RoHS: YES; Stock 1: 5038; Pricing 1: 10=0.16, 100=0.0929, 500=0.076, 1000=0.0618, 2000=0.0605, 4000=0.0425, 20000=0.0409, 40000=0.0355 (GBP); Packaging: Cut Tape; Operating Temperature Min: -55; Operating Temperature Max: 85; Automotive Qualification Standard: -; MSL: MSL 1 - Unlimited; ComponentLink1URL: http://www.farnell.com/datasheets/2079168.pdf; ComponentLink1Description: http://www.farnell.com/datasheets/2079168.pdf; Supplier Part Number 1: 2611924
C16 = C - 2.2uF/6V3/0402: CAP CER 2.2UF 6.3V 20% X5R 0402; Manufacturer: Murata; Manufacturer Part Number: GRM155R60J225ME15D; IRNAS Part No.: /; Material: Ceramic; Supplier 1: Farnell; Stock 1: 0; Pricing 1: 10=0.118, 100=0.0494, 500=0.031, 2500=0.0213, 5000=0.0163 (EUR); Mount: Surface Mount; Case/Package: 0402; Case Code (Metric): 1005; Case Code (Imperial): 0402; Min Operating Temperature: -55°C; Max Operating Temperature: 85°C; Packaging: Tape and Reel; Capacitance: 2.2uF; Tolerance: 20%; Package Quantity: 10000; Voltage Rating: 6.3V; Voltage Rating (DC): 6.3V; Dielectric: X5R; Termination: SMD/SMT; Voltage: 6.3V; Length: 1mm; Height: 0.5mm; Width: 0.02inch; Thickness: 0.022inch; Depth: 0.5mm; Radiation Hardening: No; REACH SVHC: No SVHC; Lead Free: Lead Free; ComponentLink1URL: https://datasheet.ciiva.com/29149/450128-da-01-de-vs-kondens-grm155-r60j-225me15d-29149006.pdf; ComponentLink1Description: https://datasheet.ciiva.com/29149/450128-da-01-de-vs-kondens-grm155-r60j-225me15d-29149006.pdf; ComponentLink2URL: https://datasheet.ciiva.com/46418/1754686-46418042.pdf; ComponentLink2Description: https://datasheet.ciiva.com/46418/1754686-46418042.pdf; ComponentLink3URL: https://datasheet.ciiva.com/17454/c02e-17454956.pdf; ComponentLink3Description: https://datasheet.ciiva.com/17454/c02e-17454956.pdf; ComponentLink4URL: https://datasheet.ciiva.com/235/partnumbering-e-01-235009.pdf; ComponentLink4Description: https://datasheet.ciiva.com/235/partnumbering-e-01-235009.pdf; ComponentLink5URL: https://datasheet.ciiva.com/2989/c02e-2989361.pdf; ComponentLink5Description: https://datasheet.ciiva.com/2989/c02e-2989361.pdf; ComponentLink6URL: https://datasheet.ciiva.com/235/partnumbering-e-01-235010.pdf; ComponentLink6Description: https://datasheet.ciiva.com/235/partnumbering-e-01-235010.pdf; ComponentLink7URL: https://datasheet.ciiva.com/235/partnumbering-e-01-235011.pdf; ComponentLink7Description: https://datasheet.ciiva.com/235/partnumbering-e-01-235011.pdf; Supplier Part Number 1: 2362088
R3 R4 = R - 10k/0402: as R1 on sheet MAIN; Supplier 1: Farnell; Manufacturer: Multicomp; Manufacturer Part Number: MCWR04X1002FTL; Stock 1: 602609; Pricing 1: 10=0.0029, 100=0.0017, 500=0.0012, 2500=0.001, 5000=0.0008 (EUR); Case/Package: 0402; Case Code (Metric): 1005; Case Code (Imperial): 0402; Packaging: Cut Tape; Composition: Thick Film; Tolerance: 1%; Voltage Rating (DC): 50V; REACH SVHC: No SVHC; ComponentLink1URL: http://www.farnell.com/datasheets/1849611.pdf; ComponentLink1Description: http://www.farnell.com/datasheets/1849611.pdf; Supplier Part Number 1: 2447096
R6 = R - 0R/0402: RESISTOR, 0402, 0R, ANTI SULFURATION; Manufacturer: Multicomp; Manufacturer Part Number: MCMR04X000PTL; IRNAS Part No.: I-100016; Voltage Rating: 50V; Resistance: 0mR; Power Rating: 62.5mW; Temperature Coefficient: 400ppm/°C; Supplier 1: Farnell; Stock 1: 0; Pricing 1: 10=0.0057, 100=0.0034, 500=0.0024, 2500=0.0019, 5000=0.0015 (EUR); Case/Package: 0402; Case Code (Metric): 1005; Case Code (Imperial): 0402; Packaging: Cut Tape; Composition: Ceramic; Voltage Rating (DC): 50V; REACH SVHC: No SVHC; ComponentLink1URL: https://datasheet.ciiva.com/7776/1716705-7776974.pdf; ComponentLink1Description: https://datasheet.ciiva.com/7776/1716705-7776974.pdf; ComponentLink2URL: https://datasheet.ciiva.com/28677/1716705-28677161.pdf; ComponentLink2Description: https://datasheet.ciiva.com/28677/1716705-28677161.pdf; Supplier Part Number 1: 2072513
R7 R9 = R - 100k/0402: as R16 on sheet MAIN; Supplier 1: Farnell; Manufacturer: Multicomp; Manufacturer Part Number: MCWR04X1003FTL; Stock 1: 161188; Pricing 1: 10=0.0029, 100=0.0017, 500=0.0012, 2500=0.001, 5000=0.0008 (EUR); Mount: Surface Mount; Case/Package: 0402; Case Code (Metric): 1005; Case Code (Imperial): 0402; Tolerance: 1%; Packaging: Cut Tape; Composition: Thick Film; Voltage Rating (DC): 50V; REACH SVHC: No SVHC; ComponentLink1URL: https://datasheet.ciiva.com/46386/1849611-46386524.pdf; ComponentLink1Description: https://datasheet.ciiva.com/46386/1849611-46386524.pdf; Supplier Part Number 1: 2447094
R8 = R - 100R/0402: as R5 on sheet MAIN; Supplier 1: Farnell; Manufacturer: Multicomp; Manufacturer Part Number: MCMR04X1000FTL; Stock 1: 62365; Pricing 1: 10=0.0071, 100=0.0042, 500=0.003, 2500=0.0024, 5000=0.0019 (GBP); Case/Package: 0402; Case Code (Metric): 1005; Case Code (Imperial): 0402; Resistance: 100R; Tolerance: 1%; Composition: Ceramic; Packaging: Cut Tape; Voltage Rating (DC): 50V; REACH SVHC: No SVHC; ComponentLink1URL: https://datasheet.ciiva.com/28692/1716705-28692087.pdf; ComponentLink1Description: https://datasheet.ciiva.com/28692/1716705-28692087.pdf; ComponentLink2URL: https://datasheet.ciiva.com/22708/1716705-22708156.pdf; ComponentLink2Description: https://datasheet.ciiva.com/22708/1716705-22708156.pdf; Supplier Part Number 1: 2072515
R20 = R - 50R: SMD Chip Resistor, 0402 [1005 Metric], 50 ohm, FC Series, 30 V, Thin Film, 50 mW; Manufacturer: Vishay; Manufacturer Part Number: CRCW060351R0FKEA; IRNAS Part No.: /; Resistance: 51R; Tolerance: 1%; Power Rating: 100mW; Voltage Rating: 75V; Temperature Coefficient: 100ppm/°C; Stock 1: 1083; Pricing 1: 10=0.0116, 250=0.0087, 500=0.0059, 1250=0.0052, 2500=0.0046 (GBP); Case/Package: 0603; Number of Pins: 2; Weight: 7.1E-05oz; Case Code (Imperial): 0603; Case Code (Metric): 1608; Contact Plating: Tin; Min Operating Temperature: -55°C; Max Operating Temperature: 155°C; Packaging: Tape and Reel; Package Quantity: 10; Composition: Thick Film; Number of Terminations: 2; Military Standard: Not; Termination: SMD/SMT; Max Power Dissipation: 100mW; Voltage Rating (DC): 75V; Working Voltage: 75V; Length: 1.55mm; Height: 0.45mm; Width: 0.85mm; Depth: 0.85mm; Radiation Hardening: No; REACH SVHC: Unknown; Lead Free: Lead Free; ComponentLink11URL: http://www.farnell.com/datasheets/2045976.pdf?_ga=2.23751994.1451481302.1563774341-1373726713.1554121096&_gac=1.92491119.1562763802.CjwKCAjwmZbpBRAGEiwADrmVXm8xT8OHDZvJe8qZIQyyGmIuiUD-TEITatw0hIdDkyBwIXXCH7oneRoCl7cQAvD_BwE; ComponentLink11Description: Datasheet; Supplier 1: Farnell; Supplier Part Number 1: 2309101
T1 = T_M - VT6M1T2CR: as T2 on sheet MAIN; Author: Ciril Golob; Date: 11.07.2018; ComponentLINK1Description: Datasheet; ComponentLINK2Description: Datasheet www; ComponentLINK1URL: c:\ELRADSVN\Altium_Library\Libraries\Active\Datasheet\BSS123.pdf; ComponentLINK2URL: http://www.onsemi.com/pub/Collateral/BSS123-D.PDF; ComponentLink1Description: Datasheet; ComponentLink1URL: http://www.farnell.com/datasheets/2198041.pdf?_ga=2.191543850.1451481302.1563774341-1373726713.1554121096&_gac=1.95045230.1562763802.CjwKCAjwmZbpBRAGEiwADrmVXm8xT8OHDZvJe8qZIQyyGmIuiUD-TEITatw0hIdDkyBwIXXCH7oneRoCl7cQAvD_BwE; Supplier 1: Farnell; Supplier Part Number 1: 2706721
U2 = MCU - CMWX1ZZABZ: RF Module, FSK, OOK, LoRa, 4.8Kbps, 915MHz, -135.5dBm, 2.2V to 3.6V, I2C, SPI, UART, USB; Manufacturer: Murata; Manufacturer Part Number: CMWX1ZZABZ-091; Stock 1: 175; Pricing 1: 1=11.7, 5=11.06, 10=9.94, 50=9.54, 100=9.14, 250=8.05 (GBP); ComponentLink1Description: Datasheet; ComponentLink1URL: D:\altium\Altium_Library\Active\Datasheet\CMWX1ZZABZ.pdf; Supplier 1: Mouser; Supplier Part Number 1: 81-CMWX1ZZABZ-091
U4 = V_LIN - MCP1810T: LDO Voltage Regulator, Fixed, 2.5 V to 5.5 V in, 2.5 V/150 mA out, 380 mV drop; Manufacturer: ON SEMICONDUCTOR; Manufacturer Part Number: LM2596DSADJG; Topology: Buck (Step Down); Input Voltage Min: 4.5; Input Voltage Max: 45; No. of Outputs: 1; DC / DC Converter IC Case: TO-263; No. of Pins: 5; Output Current: 3; Output Voltage Min: 1.23; Output Voltage Max: 37; Switching Frequency: 150; SVHC: No SVHC (12-Jan-2017; RoHS: YES; Stock 1: 342; Pricing 1: 1=1.98, 10=1.49, 100=1.19, 500=1.04, 1000=0.859, 2500=0.785 (GBP); Operating Temperature Max: 125; Packaging: Each; Product Range: -; Automotive Qualification Standard: -; MSL: MSL 1 - Unlimited; Supplier 1: Farnell; Supplier 2: Mouser; Supplier 3: Digi-Key; Supplier Part Number 1: 2678432; Supplier Part Number 2: 579-MCP1810T-25I/J8A; Supplier Part Number 3: MCP1810T-25I/J8ADKR-ND
U5 = RF - HHM22106C1: Signal Conditioning DIRECTIONAL COUPLER 700-2700MHz; Manufacturer: u-blox; Manufacturer Part Number: MAX-M8Q-0; Stock 1: 10805; ComponentLink1Description: Datasheet; ComponentLink1URL: https://eu.mouser.com/datasheet/2/400/f_coupler_hhm22106c1_en-1308651.pdf; Supplier 1: Mouser; Supplier Part Number 1: 810-HHM22106C1
U6 = RF - LMH2110TMX: RF Detector IC GSM, EDGE, CDMA 50MHz ~ 8GHz -40dBm ~ 5dBm ±0,5dB; Manufacturer: u-blox; Manufacturer Part Number: MAX-M8Q-0; Stock 1: 10805; ComponentLink1Description: Datasheet; ComponentLink1URL: http://www.ti.com/lit/ds/symlink/lmh2110.pdf; Supplier 1: Mouser; Supplier Part Number 1: 926-LMH2110TMX/NOPB

## Nets that join several sheets
+2.5V: MAIN (6 pins), SENSORS (6 pins), MCU (12 pins)
GND: MAIN (20 pins), SENSORS (10 pins), MCU (33 pins)
VBAT: MAIN (5 pins), MCU (5 pins)
A_INT1: SENSORS (U1.12), MCU (U2.37)
A_INT2: SENSORS (U1.11), MCU (U2.38)
BAT_AN: MAIN (C12.2 R12.1 R18.2), MCU (U2.22)
BAT_MON_EN: MAIN (R17.1), MCU (U2.45)
LED: MAIN (R5.1), MCU (U2.33)
LIGHT_PW: SENSORS (C8.1 U3.3), MCU (U2.40)
LORA_ANT: MAIN (C19.1 L2.2), MCU (U5.1)
REED: SENSORS (U8.2), MCU (U2.46)
RESET: MAIN (R13.1), MCU (C3.2 R4.1 U2.34)
SCL: MAIN (R1.1), SENSORS (U1.1 U3.1), MCU (U2.35)
SCLK: MAIN (U7.3), MCU (U2.16)
SDA: MAIN (R2.1), SENSORS (U1.4 U3.2), MCU (U2.36)
SDAT: MAIN (U7.12), MCU (U2.14)
SEN: MAIN (U7.1), MCU (U2.17)
SWCLK: MAIN (R14.2), MCU (U2.42)
SWDIO: MAIN (R10.2), MCU (U2.41)
UART2_TX: MAIN (R15.2), MCU (U2.24)

## Assembly variants
BASIC: all parts fitted